# EAGLE board DE0EC8 (EAGLE 5.10), part 1 of 2
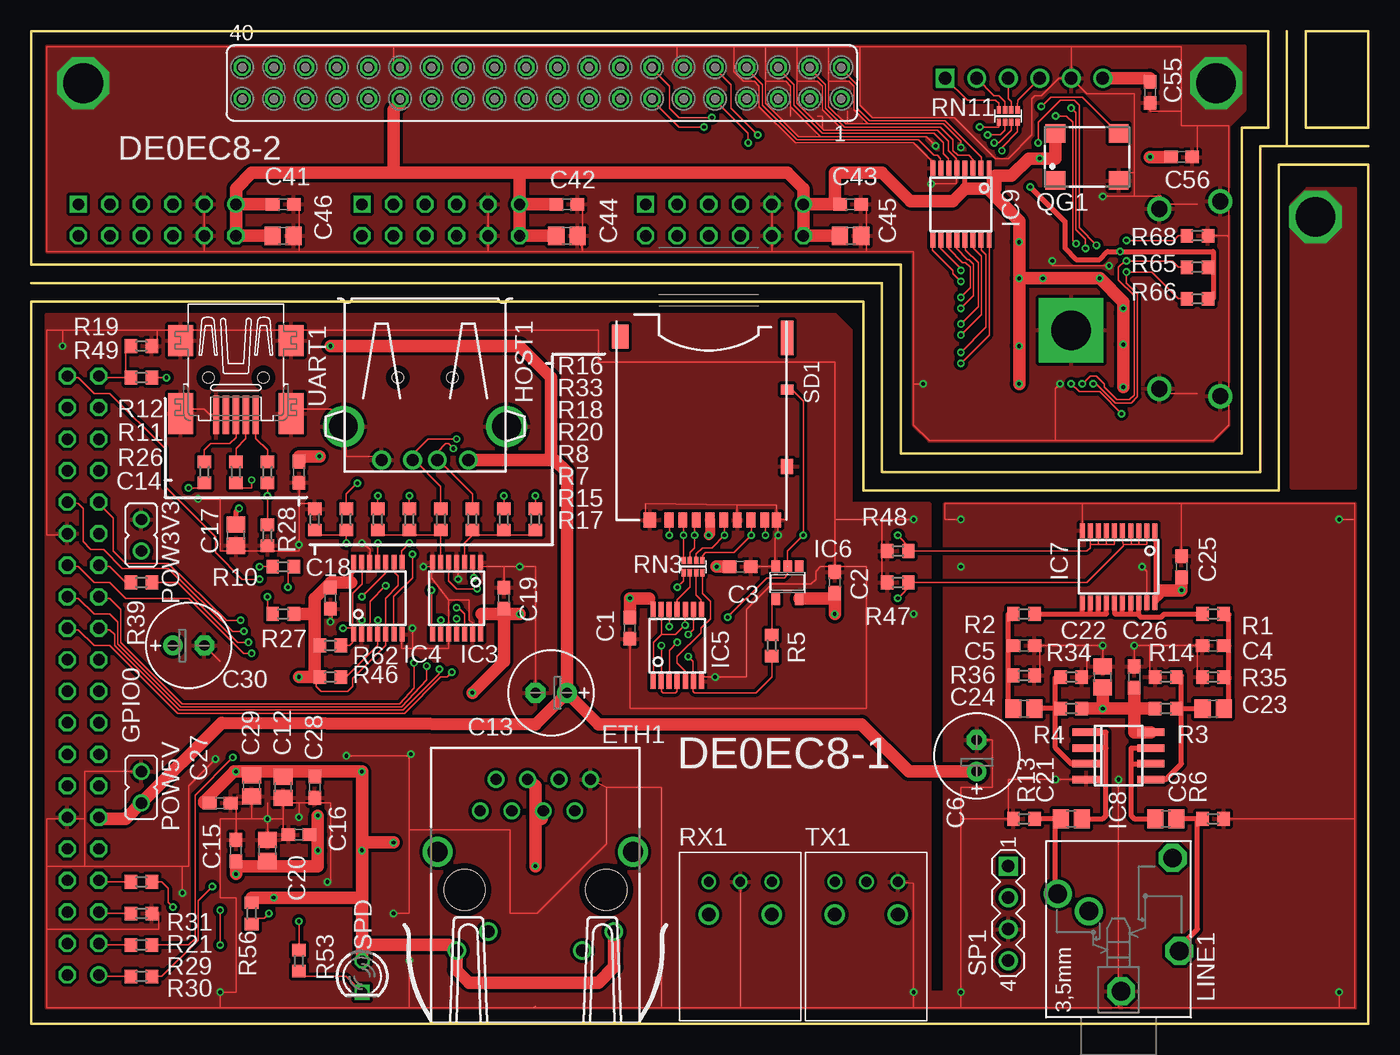
[diagram p2: board, top side]
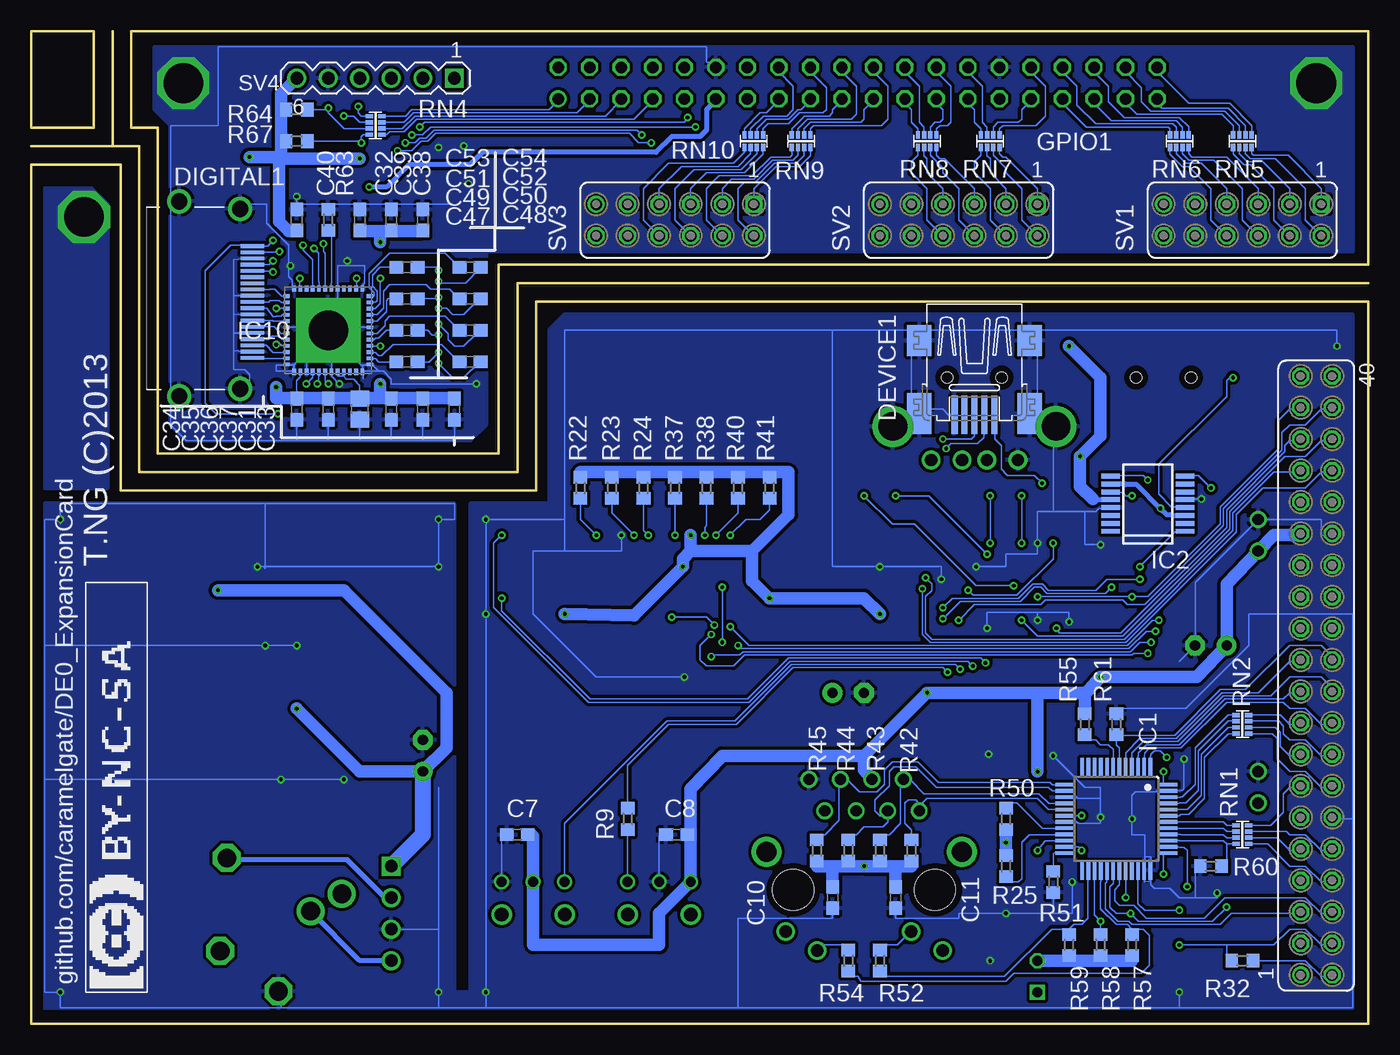
[diagram p3: board, bottom side, seen from below]

Size 107.77 x 80 mm. Coordinates in mm from the lower left corner, seen from the top.
Outline: 0,59.69 68.58,59.69 68.58,44.45 99.06,44.45 99.06,70.72 101.2,70.72
Outline: 101.2,70.72 101.2,80
Outline: 107.77,70.72 101.2,70.72
Outline: 0,0 107.77,0 107.77,69.22 100.56,69.22 100.56,42.95 67.08,42.95 67.08,58.19 0,58.19 0,0
Outline: 0,80 0,61.19 70.08,61.19 70.08,45.95 97.56,45.95 97.56,72.22 99.7,72.22 99.7,80 0,80
Outline: 107.77,80 102.7,80 102.7,72.22 107.77,72.22 107.77,80
Copper layers (1*16): Top 0.035mm / dielectric 1.53mm / Bottom 0.035mm
Design rules "pban_5mil-l2": minimum track width 5mil, minimum drill 0.3mm, track to track 5mil, track to pad 0.229mm, pad to pad 5mil, via to via 5mil, smd to smd 5mil, copper to edge 0.5mm, drill to drill 0.5mm, minimum pad ring 0.15mm, minimum via ring 0.15mm, stop-mask expansion 4mil, vias tented up to drill 0.35mm, thermal gap 10mil

## Footprints (pad centres in the part's own frame; a part is rotated, then mirrored left to right if it is on the bottom)
C1608 = smd 1.1 x 1: 1 -0.85,0; 2 0.85,0
E2,5-7 = drill 0.813 pad 1.6 round: + -1.27,0 | drill 0.813 pad 1.6 octagon: - 1.27,0
C2012 = smd 1.3 x 1.5: 1 -0.85,0; 2 0.85,0
32005-201 = smd 3.1 x 0.5: 1 3,1.6; 2 3,0.8; 3 3,0; 4 3,-0.8; 5 3,-1.6 | smd 2.5 x 2: M1 -3,-4.45; M2 -3,4.45 | smd 3.3 x 2: M3 2.9,4.45; M4 2.9,-4.45 | hole 0.9: 0,2.2; 0,-2.2
HDMI-FCI-A-UPDATE = smd 0.3 x 1.9: 1 4.75,8.5; 2 4.25,8.5; 3 3.75,8.5; 4 3.25,8.5; 5 2.75,8.5; 6 2.25,8.5; 7 1.75,8.5; 8 1.25,8.5; 9 0.75,8.5; 10 0.25,8.5; 11 -0.25,8.5; 12 -0.75,8.5; 13 -1.25,8.5; 14 -1.75,8.5; 15 -2.25,8.5; 16 -2.75,8.5; 17 -3.25,8.5; 18 -3.75,8.5; 19 -4.25,8.5 | drill 1.3 round: 20 -7.85,2.6; 21 7.85,2.6; 22 -7.25,7.5; 23 7.25,7.5
J0B = drill 0.9 pad 1.3 round: 1 -4.445,-1.27; 2 -3.175,1.27; 3 -1.905,-1.27; 4 -0.635,1.27; 5 0.635,-1.27; 6 1.905,1.27; 7 3.175,-1.27; 8 4.445,1.27 | drill 1 pad 1.422 round: 9 -6.325,-12.52; 10 -3.785,-11; 11 3.785,-12.52; 12 6.325,-11 | drill 1.6 pad 2.184 round: M1 -7.875,-4.57; M2 7.875,-4.57 | hole 3.3: 5.715,-7.62; -5.715,-7.62
FE20-2 = drill 0.914 round: 1 -24.13,1.27 | drill 0.914 octagon: 2 -24.13,-1.27; 3 -21.59,1.27; 4 -21.59,-1.27; 5 -19.05,1.27; 6 -19.05,-1.27; 7 -16.51,1.27; 8 -16.51,-1.27; 9 -13.97,1.27; 10 -13.97,-1.27; 11 -11.43,1.27; 12 -11.43,-1.27; 13 -8.89,1.27; 14 -8.89,-1.27; 15 -6.35,1.27; 16 -6.35,-1.27; 17 -3.81,1.27; 18 -3.81,-1.27; 19 -1.27,1.27; 20 -1.27,-1.27; 21 1.27,1.27; 22 1.27,-1.27; 23 3.81,1.27; 24 3.81,-1.27; 25 6.35,1.27; 26 6.35,-1.27; 27 8.89,1.27; 28 8.89,-1.27; 29 11.43,1.27; 30 11.43,-1.27; 31 13.97,1.27; 32 13.97,-1.27; 33 16.51,1.27; 34 16.51,-1.27; 35 19.05,1.27; 36 19.05,-1.27; 37 21.59,1.27; 38 21.59,-1.27; 39 24.13,1.27; 40 24.13,-1.27
USB-A = drill 1 round: 1 -3.5,12.99; 2 -1,12.99; 3 1,12.99; 4 3.5,12.99 | drill 2.3 round: P$1 -6.57,10.28; P$2 6.57,10.28
LQFP48 = smd 1.5 x 0.3: 1 -4.15,2.75; 2 -4.15,2.25; 3 -4.15,1.75; 4 -4.15,1.25; 5 -4.15,0.75; 6 -4.15,0.25; 7 -4.15,-0.25; 8 -4.15,-0.75; 9 -4.15,-1.25; 10 -4.15,-1.75; 11 -4.15,-2.25; 12 -4.15,-2.75; 25 4.15,-2.75; 26 4.15,-2.25; 27 4.15,-1.75; 28 4.15,-1.25; 29 4.15,-0.75; 30 4.15,-0.25; 31 4.15,0.25; 32 4.15,0.75; 33 4.15,1.25; 34 4.15,1.75; 35 4.15,2.25; 36 4.15,2.75 | smd 0.3 x 1.5: 13 -2.75,-4.15; 14 -2.25,-4.15; 15 -1.75,-4.15; 16 -1.25,-4.15; 17 -0.75,-4.15; 18 -0.25,-4.15; 19 0.25,-4.15; 20 0.75,-4.15; 21 1.25,-4.15; 22 1.75,-4.15; 23 2.25,-4.15; 24 2.75,-4.15; 37 2.75,4.15; 38 2.25,4.15; 39 1.75,4.15; 40 1.25,4.15; 41 0.75,4.15; 42 0.25,4.15; 43 -0.25,4.15; 44 -0.75,4.15; 45 -1.25,4.15; 46 -1.75,4.15; 47 -2.25,4.15; 48 -2.75,4.15
FT230X = smd 0.4 x 1.5: 1 -2.223,-2.99; 2 -1.587,-2.99; 3 -0.953,-2.99; 4 -0.318,-2.99; 5 0.318,-2.99; 6 0.953,-2.99; 7 1.587,-2.99; 8 2.223,-2.99; 9 2.223,2.99; 10 1.587,2.99; 11 0.953,2.99; 12 0.318,2.99; 13 -0.318,2.99; 14 -0.953,2.99; 15 -1.587,2.99; 16 -2.223,2.99
PW_R-PDSO-G14 = smd 0.4 x 1.2: 1 -1.95,-2.9; 2 -1.3,-2.9; 3 -0.65,-2.9; 4 0,-2.9; 5 0.65,-2.9; 6 1.3,-2.9; 7 1.95,-2.9; 8 1.95,2.9; 9 1.3,2.9; 10 0.65,2.9; 11 0,2.9; 12 -0.65,2.9; 13 -1.3,2.9; 14 -1.95,2.9
SOT23-5 = smd 0.69 x 0.99: 1 -0.95,-1.29; 2 0,-1.29; 3 0.95,-1.29; 4 0.95,1.3; 5 -0.95,1.3
PW_R-PDSO-G20 = smd 0.4 x 1.2: 1 -2.925,-2.9; 2 -2.275,-2.9; 3 -1.625,-2.9; 4 -0.975,-2.9; 5 -0.325,-2.9; 6 0.325,-2.9; 7 0.975,-2.9; 8 1.625,-2.9; 9 2.275,-2.9; 10 2.925,-2.9; 11 2.925,2.9; 12 2.275,2.9; 13 1.625,2.9; 14 0.975,2.9; 15 0.325,2.9; 16 -0.325,2.9; 17 -0.975,2.9; 18 -1.625,2.9; 19 -2.275,2.9; 20 -2.925,2.9
SO08 = smd 0.6 x 2.2: 1 -1.905,-2.6; 2 -0.635,-2.6; 3 0.635,-2.6; 4 1.905,-2.6; 5 1.905,2.6; 6 0.635,2.6; 7 -0.635,2.6; 8 -1.905,2.6
PW_R-PDSO-G16 = smd 0.4 x 1.2: 1 -2.275,-2.9; 2 -1.625,-2.9; 3 -0.975,-2.9; 4 -0.325,-2.9; 5 0.325,-2.9; 6 0.975,-2.9; 7 1.625,-2.9; 8 2.275,-2.9; 9 2.275,2.9; 10 1.625,2.9; 11 0.975,2.9; 12 0.325,2.9; 13 -0.325,2.9; 14 -0.975,2.9; 15 -1.625,2.9; 16 -2.275,2.9
QFN48-A = smd 0.5 x 0.3: 1 -3.35,2.75; 2 -3.35,2.25; 3 -3.35,1.75; 4 -3.35,1.25; 5 -3.35,0.75; 6 -3.35,0.25; 7 -3.35,-0.25; 8 -3.35,-0.75; 9 -3.35,-1.25; 10 -3.35,-1.75; 11 -3.35,-2.25; 12 -3.35,-2.75; 25 3.35,-2.75; 26 3.35,-2.25; 27 3.35,-1.75; 28 3.35,-1.25; 29 3.35,-0.75; 30 3.35,-0.25; 31 3.35,0.25; 32 3.35,0.75; 33 3.35,1.25; 34 3.35,1.75; 35 3.35,2.25; 36 3.35,2.75 | smd 0.3 x 0.5: 13 -2.75,-3.35; 14 -2.25,-3.35; 15 -1.75,-3.35; 16 -1.25,-3.35; 17 -0.75,-3.35; 18 -0.25,-3.35; 19 0.25,-3.35; 20 0.75,-3.35; 21 1.25,-3.35; 22 1.75,-3.35; 23 2.25,-3.35; 24 2.75,-3.35; 37 2.75,3.35; 38 2.25,3.35; 39 1.75,3.35; 40 1.25,3.35; 41 0.75,3.35; 42 0.25,3.35; 43 -0.25,3.35; 44 -0.75,3.35; 45 -1.25,3.35; 46 -1.75,3.35; 47 -2.25,3.35; 48 -2.75,3.35 | drill 3.2 pad 5.2 square: EXP 0,0
PG203JA = drill 1.499 octagon: 1 -5.004,-0.203; 4 5.74,-4.369; 5 -1.753,-4.902 | drill 1.499 round: 2 2.845,4.902; 3 1.448,2.388
JP1A = drill 0.914 round: 1 0,-1.27; 2 0,1.27
SM77H = smd 1.6 x 1.5: 1 -2.55,-1.9; 2 2.55,-1.9; 3 2.55,1.9; 4 -2.55,1.9
R0603 = smd 1 x 1.1: 1 -0.85,0; 2 0.85,0
EXB28V = smd 0.35 x 0.6: 1 -0.75,-0.5; 2 -0.25,-0.5; 3 0.25,-0.5; 4 0.75,-0.5; 5 0.75,0.5; 6 0.25,0.5; 7 -0.25,0.5; 8 -0.75,0.5
PL_13X/T10 = drill 0.8 round: 1 2.54,0; 2 0,0; 3 -2.54,0 | drill 1.1 round: 4 2.54,2.63; 5 -2.54,2.63
DM3A-SF-PEJ-A = smd 0.7 x 1.2: 1 3.2,16.55; 2 2.1,16.55; 3 1,16.55; 4 -0.1,16.55; 5 -1.2,16.55; 6 -2.3,16.55; 7 -3.4,16.55; 8 -4.5,16.55; CD1 -5.45,16.55 | smd 1 x 0.8: CD2 -6.325,6.05 | smd 1 x 1.2: GND1 4.75,16.55; GND2 -6.3,12.25 | smd 1 x 2.8: GND3 -6.325,1.875 | smd 1.3 x 1.9: GND4 7.125,1.775
MA04-1A = drill 1.016 square: 1 -3.81,0 | drill 1.016 round: 2 -1.27,0; 3 1.27,0; 4 3.81,0
LED3MM = drill 0.813 octagon: A -1.27,0 | drill 0.813 square: K 1.27,0
FE06-2P = drill 0.914 square: 1 6.35,1.27 | drill 0.914 octagon: 2 6.35,-1.27; 3 3.81,1.27; 4 3.81,-1.27; 5 1.27,1.27; 6 1.27,-1.27; 7 -1.27,1.27; 8 -1.27,-1.27; 9 -3.81,1.27; 10 -3.81,-1.27; 12 -6.35,-1.27 | drill 0.914 round: 11 -6.35,1.27
MA06-1A = drill 1.016 square: 1 -6.35,0 | drill 1.016 round: 2 -3.81,0; 3 -1.27,0; 4 1.27,0; 5 3.81,0; 6 6.35,0

## Placement (x,y rotation side)
C1  0.1u  [C1608]  48.26,31.88 90 top
C2  0.1u  [C1608]  64.77,35.56 270 top
C3  0.1u  [C1608]  57.15,36.83 180 top
C4  220p  [C1608]  95.25,30.48 180 top
C5  220p  [C1608]  80.01,30.48 0 top
C6  47uF  [E2,5-7]  76.2,21.59 90 top
C7  0.1u  [C1608]  68.58,15.24 0 bottom
C8  0.1u  [C1608]  55.75,15.24 0 bottom
C9  10u  [C2012]  91.44,16.51 0 top
C10  0.1u  [C1608]  43.18,10.16 270 bottom
C11  0.1u  [C1608]  38.1,10.16 270 bottom
C12  10u  [C2012]  20.32,19.05 270 top
C13  47uF  [E2,5-7]  41.91,26.67 180 top
C14  0.1u  [C1608]  21.59,44.45 90 top
C15  0.1u  [C1608]  16.51,13.97 90 top
C16  0.1u  [C1608]  21.59,15.24 180 top
C17  10u  [C2012]  16.51,39.37 90 top
C18  0.1u  [C1608]  24.13,34.29 90 top
C19  0.1u  [C1608]  38.1,34.29 270 top
C20  10u  [C2012]  19.05,13.97 90 top
C21  10u  [C2012]  83.82,16.51 180 top
C22  10u  [C2012]  86.36,27.94 90 top
C23  10u  [C2012]  95.25,25.4 180 top
C24  10u  [C2012]  80.01,25.4 0 top
C25  0.1u  [C1608]  92.71,36.83 270 top
C26  0.1u  [C1608]  88.9,27.94 270 top
C27  0.1u  [C1608]  15.24,17.78 0 top
C28  0.1u  [C1608]  22.86,19.05 270 top
C29  10u  [C2012]  17.78,19.18 270 top
C30  47uF  [E2,5-7]  12.7,30.48 0 top
C31  0.1uF  [C1608]  76.2,49.53 270 bottom
C32  0.1uF  [C1608]  81.28,64.77 90 bottom
C33  0.1uF  [C1608]  73.66,49.53 270 bottom
C34  0.1uF  [C1608]  86.36,49.53 270 bottom
C35  0.1uF  [C1608]  83.82,49.53 270 bottom
C36  0.1uF  [C1608]  78.74,49.53 270 bottom
C37  10u  [C2012]  81.28,49.53 270 bottom
C38  0.1uF  [C1608]  76.2,64.77 90 bottom
C39  0.1uF  [C1608]  78.74,64.77 90 bottom
C40  0.1uF  [C1608]  86.36,64.77 90 bottom
C41  0.1uF  [C1608]  20.32,66.04 180 top
C42  0.1uF  [C1608]  43.18,66.04 180 top
C43  0.1uF  [C1608]  66.04,66.04 180 top
C44  10u  [C2012]  43.18,63.5 180 top
C45  10u  [C2012]  66.04,63.5 180 top
C46  10u  [C2012]  20.32,63.5 180 top
C47  0.1uF  [C1608]  77.47,53.34 180 bottom
C48  0.1uF  [C1608]  72.39,53.34 180 bottom
C49  0.1uF  [C1608]  77.47,55.88 180 bottom
C50  0.1uF  [C1608]  72.39,55.88 180 bottom
C51  0.1uF  [C1608]  77.47,58.42 180 bottom
C52  0.1uF  [C1608]  72.39,58.42 180 bottom
C53  0.1uF  [C1608]  77.47,60.96 180 bottom
C54  0.1uF  [C1608]  72.39,60.96 180 bottom
C55  0.1uF  [C1608]  90.17,75.06 90 top
C56  0.1uF  [C1608]  92.71,69.85 0 top
DEVICE1  MINI-USB-SCHIELD-32005-201  [32005-201]  31.75,52.07 270 bottom
DIGITAL1  [HDMI-FCI-A-UPDATE]  98.42,58.42 270 bottom
ETH1  J0011D21BNL  [J0B]  40.64,18.41 0 top
GPIO0  [FE20-2]  4.2,28.06 90 bottom
GPIO1  [FE20-2]  41.16,75.8 180 top
HOST1  [USB-A]  31.75,58.42 180 top
IC1  DP83848C  [LQFP48]  20.32,16.51 270 bottom
IC2  FT230X  [FT230X]  17.78,41.91 90 bottom
IC3  74CBTLV3125TSSOP  [PW_R-PDSO-G14]  34.29,34.29 180 top
IC4  74VHC125TSSOP  [PW_R-PDSO-G14]  27.94,34.29 0 top
IC5  74VHC125TSSOP  [PW_R-PDSO-G14]  52.07,30.48 0 top
IC6  74LVC1G04DBV  [SOT23-5]  60.96,35.56 180 top
IC7  74VHC245TSSOP  [PW_R-PDSO-G20]  87.63,36.83 180 top
IC8  LM358D  [SO08]  87.63,21.59 270 top
IC9  FIN1047  [PW_R-PDSO-G16]  74.93,66.04 180 top
IC10  PTN3360D  [QFN48-A]  83.82,55.88 270 bottom
LINE1  AJ1780  [PG203JA]  87.63,7.62 90 top
POW3V3  [JP1A]  8.89,39.37 180 top
POW5V  [JP1A]  8.89,19.05 180 top
QG1  27MHz  [SM77H]  85.09,69.85 0 top
R1  2.2k  [R0603]  95.25,33.02 0 top
R2  2.2k  [R0603]  80.01,33.02 180 top
R3  100k  [R0603]  91.44,25.4 180 top
R4  100k  [R0603]  83.82,25.4 0 top
R5  10k  [R0603]  59.69,30.48 270 top
R6  56k  [R0603]  95.25,16.51 0 top
R7  22  [R0603]  35.56,40.64 90 top
R8  22  [R0603]  33.02,40.64 90 top
R9  100  [R0603]  59.69,16.51 270 bottom
R10  100  [R0603]  20.32,36.83 180 top
R11  22  [R0603]  16.51,44.45 90 top
R12  22  [R0603]  13.97,44.45 90 top
R13  56k  [R0603]  80.01,16.51 180 top
R14  100k  [R0603]  91.44,27.94 0 top
R15  1.5k  [R0603]  38.1,40.64 90 top
R16  10k  [R0603]  22.86,40.64 270 top
R17  15k  [R0603]  40.64,40.64 270 top
R18  15k  [R0603]  27.94,40.64 270 top
R19  10k  [R0603]  8.89,54.61 180 top
R20  1.5k  [R0603]  30.48,40.64 90 top
R21  10k  [R0603]  8.89,8.89 180 top
R22  10k  [R0603]  63.5,43.18 90 bottom
R23  10k  [R0603]  60.96,43.18 90 bottom
R24  10k  [R0603]  58.42,43.18 90 bottom
R25  2.2k  [R0603]  29.21,12.7 90 bottom
R26  4.7k(4.87k)  [R0603]  19.05,44.45 90 top
R27  10k  [R0603]  20.32,33.02 180 top
R28  10k  [R0603]  19.05,39.37 90 top
R29  100  [R0603]  8.89,6.35 0 top
R30  100  [R0603]  8.89,3.81 0 top
R31  100  [R0603]  8.89,11.43 0 top
R32  100  [R0603]  10.16,5.08 180 bottom
R33  1.5k  [R0603]  25.4,40.64 90 top
R34  100k  [R0603]  83.82,27.94 180 top
R35  2.2k  [R0603]  95.25,27.94 180 top
R36  2.2k  [R0603]  80.01,28.07 180 top
R37  10k  [R0603]  55.88,43.18 90 bottom
R38  10k  [R0603]  53.34,43.18 90 bottom
R39  100  [R0603]  8.89,35.56 0 top
R40  10k  [R0603]  50.8,43.18 90 bottom
R41  10k  [R0603]  48.26,43.18 90 bottom
R42  50  [R0603]  36.83,13.97 270 bottom
R43  50  [R0603]  39.37,13.97 270 bottom
R44  50  [R0603]  41.91,13.97 270 bottom
R45  50  [R0603]  44.45,13.97 270 bottom
R46  10k  [R0603]  24.13,27.94 0 top
R47  10k  [R0603]  69.85,35.56 0 top
R48  10k  [R0603]  69.85,38.1 0 top
R49  100  [R0603]  8.89,52.07 0 top
R50  2.2k  [R0603]  29.21,16.51 270 bottom
R51  4.87k  [R0603]  25.4,11.43 270 bottom
R52  120  [R0603]  39.37,5.08 90 bottom
R53  220  [R0603]  21.59,5.08 270 top
R54  120  [R0603]  41.91,5.08 90 bottom
R55  10k  [R0603]  22.86,24.13 90 bottom
R56  1.5k  [R0603]  17.78,8.89 270 top
R57  2.2k  [R0603]  19.05,6.35 270 bottom
R58  2.2k  [R0603]  21.59,6.35 270 bottom
R59  2.2k  [R0603]  24.13,6.35 270 bottom
R60  10k  [R0603]  12.7,12.7 0 bottom
R61  10k  [R0603]  20.32,24.13 270 bottom
R62  10k  [R0603]  24.13,30.48 0 top
R63  10k  [R0603]  83.82,64.77 270 bottom
R64  10k  [R0603]  86.36,73.66 180 bottom
R65  2.2k  [R0603]  93.98,60.96 0 top
R66  2.2k  [R0603]  93.98,58.42 0 top
R67  10k  [R0603]  86.36,71.12 180 bottom
R68  22k  [R0603]  93.98,63.5 180 top
RN1  100  [EXB28V]  10.16,15.24 90 bottom
RN2  100  [EXB28V]  10.16,24.13 90 bottom
RN3  100  [EXB28V]  53.34,36.83 0 top
RN4  100  [EXB28V]  80.01,72.39 90 bottom
RN5  100  [EXB28V]  10.16,71.12 180 bottom
RN6  100  [EXB28V]  15.24,71.12 180 bottom
RN7  100  [EXB28V]  30.48,71.12 180 bottom
RN8  100  [EXB28V]  35.56,71.12 180 bottom
RN9  100  [EXB28V]  45.72,71.12 180 bottom
RN10  100  [EXB28V]  49.53,71.12 180 bottom
RN11  100  [EXB28V]  78.74,73.15 0 top
RX1  PLR135T10  [PL_13X/T10]  57.15,11.43 180 top
SD1  USD-SOCKETHIROSE-A  [DM3A-SF-PEJ-A]  54.61,57.15 180 top
SP1  [MA04-1A]  78.74,8.89 270 top
SPD  [LED3MM]  26.67,3.81 270 top
SV1  [FE06-2P]  10.16,64.77 0 bottom
SV2  [FE06-2P]  33.02,64.77 0 bottom
SV3  [FE06-2P]  55.88,64.77 0 bottom
SV4  [MA06-1A]  80.01,76.2 180 bottom
TX1  PLT133T10  [PL_13X/T10]  67.31,11.43 180 top
UART1  MINI-USB-SCHIELD-32005-201  [32005-201]  16.51,52.07 270 top

## Tracks (layer width: path | path; a pad name or v marks a point on that pad's centre or on a via)
+3V3  (via drill 0.3)
  Top 0.127: 28.57,30.48 28.59,30.97 IC4.5 28.59,31.48 28.57,31.75 28.57,34.29 29.59,35.31 29.59,36.07 29.21,36.45 29.21,36.96 29.24,37.11 IC4.9 29.21,37.22 29.21,37.72 | 28.57,30.48 28.57,31.11 | 28.57,30.48 25.91,27.81 25.91,27.18 25.53,26.8 23.37,26.8 22.99,27.18 22.99,27.94 v21.59,27.94
  Top 0.406: IC5.14 50.12,33.95 49.78,34.29 | IC4.14 25.99,36.53 25.78,36.32 25.78,35.56 | IC3.14 36.24,32.94 36.32,33.02
  Top 0.813: v54.61,39.37 54.74,39.48 54.74,40.6 SD1.4
  Top 1.016: v55.24,36.83 C3.2 | 49.78,34.29 v48.26,34.29 C1.2 | v64.77,33.02 64.77,34.16 | 64.77,34.16 C2.2 | IC6.5 61.95,34.26 61.98,34.29 64.64,34.29 64.77,34.16 | 22.86,33.02 R27.1 | 22.86,27.94 R46.1 | 22.86,30.48 R62.1 | 38.1,33.02 C19.2 | v35.56,26.67 38.1,29.21 38.1,33.02 | 38.1,33.02 v39.37,33.02 | ETH1.4 40.64,19.18 40.64,16.64 | ETH1.5 41.15,16.51 40.64,16.64 | 40.64,16.64 v40.64,12.7 | 34.24,5.77 ETH1.9 34.31,5.74 34.29,5.71 | 26.67,6.35 33.66,6.35 34.24,5.77 | 34.24,5.77 34.29,5.71 | SPD.A 26.67,6.35 | 26.67,6.35 26.67,10.16 | R56.1 17.78,10.16 v19.56,10.16 26.67,10.16 | 24.13,35.56 C18.2 | 24.13,35.56 25.78,35.56 | 38.1,33.02 36.32,33.02 | 26.67,14.61 v26.67,20.32 22.86,20.32 | 26.67,14.61 v26.67,13.97 26.67,10.16 | 26.67,14.61 v29.21,14.61 | 22.86,20.32 20.32,20.32 | 20.32,20.32 17.78,20.32 | 17.78,20.32 v16.51,20.32 16.38,20.32 13.97,17.91 13.97,17.78 C27.1 | 24.13,35.56 22.86,34.29 22.86,33.02 | 22.86,20.32 C28.1 | 20.32,20.32 C12.1 | 17.78,20.32 C29.1 | 22.86,30.48 22.86,33.02 | v21.59,27.94 22.86,27.94 | 22.86,27.94 22.86,30.48 | ETH1.12 46.97,7.01 46.99,6.35 46.99,4.57 45.72,3.3 35.31,3.3 34.29,4.32 34.29,5.71
  Bottom 0.127: IC1.22 24.74,14.76 24.77,14.73 26.04,14.73 v26.67,13.97 | IC1.32 19.57,11.82 19.56,11.81 v19.56,10.16 | IC1.48 16.47,19.26 16.51,19.3 v16.51,20.32
  Bottom 1.016: GPIO0.29 5.46,39.37 7.62,39.37 POW3V3.2 11.43,35.43 C30.+ 13.84,27.94 v21.59,27.94 22.86,26.54 | 54.61,38.23 54.61,38.1 55.24,37.47 v55.24,36.83 59.18,32.89 v64.77,33.02 | 54.61,38.23 v54.61,39.37 | R22.2 63.5,44.45 60.96,44.45 | 48.26,44.45 46.74,44.45 46.74,41.02 49.66,38.1 | 48.26,44.45 50.67,44.45 | 50.67,44.45 53.34,44.45 | 53.34,44.45 55.75,44.45 | 55.75,44.45 58.55,44.45 | 58.55,44.45 60.96,44.45 | 49.66,38.1 54.48,38.1 54.61,38.23 | 48.26,44.45 R41.2 | R40.2 50.8,44.32 50.67,44.45 | 53.34,44.45 R38.2 | R37.2 55.88,44.32 55.75,44.45 | R24.2 58.42,44.32 58.55,44.45 | 60.96,44.45 R23.2 | 49.66,38.1 49.66,35.69 v48.26,34.29 40.64,34.29 v39.37,33.02 | 26.67,26.67 v35.56,26.67 40.64,21.59 | C7.2 67.44,15.24 67.31,15.11 TX1.2 67.31,6.35 57.15,6.35 57.15,8.89 RX1.1 | C8.2 54.61,15.24 RX1.1 | RX1.1 54.61,18.92 52.07,21.59 40.64,21.59 | 40.64,21.59 40.64,20.45 ETH1.4 | R45.2 44.45,13.08 44.32,12.95 44.32,12.7 | 44.32,12.7 44.45,12.7 | 37.85,12.7 36.83,12.7 R42.2 | 39.37,12.7 37.85,12.7 | 43.18,12.7 44.32,12.7 | C11.1 38.1,12.32 37.85,12.7 | 39.37,12.7 R43.2 | R44.2 41.91,12.95 41.78,12.7 | 43.18,12.7 C10.1 | 41.78,12.7 v40.64,12.7 39.37,12.7 | 41.78,12.7 43.18,12.7 | 21.59,5.08 19.05,5.08 R57.2 | 21.59,5.08 R58.2 | 21.59,5.08 24.13,5.08 | 24.13,5.08 R59.2 | 24.13,5.08 SPD.A | 22.86,26.54 R55.2 | 26.67,26.67 22.86,26.67 22.86,26.54 | v26.67,20.32 26.67,26.67 | R25.2 v29.21,14.61 R50.2
+5V  (via drill 0.3)
  Top 0.406: 91.06,34.92 91.06,34.41 IC7.20 90.68,34.05 90.68,38.86 90.56,38.98 IC7.1
  Top 1.016: GPIO0.11 5.46,16.5 6.35,16.51 7.62,16.51 POW5V.2 15.37,24.26 40.64,24.13 C13.+ | C13.+ 45.72,24.13 66.93,24.13 70.74,20.32 C6.+ | 41.91,45.43 42.2,45.43 43.18,44.45 C13.+ | 41.91,45.43 HOST1.1 | 21.63,45.3 C14.2 21.59,45.72 v23.24,45.72 | v24.13,54.61 39.37,54.61 41.91,52.07 41.91,45.43 | 86.36,27.05 C22.1 v86.36,25.4 | 86.36,27.05 86.42,26.99 86.36,26.67 v86.36,25.4 | 88.9,25.4 C26.2 | IC8.8 88.9,23.5 88.9,25.4 | 88.9,25.4 R3.2 | v86.36,25.4 R4.2 | v86.36,25.4 88.9,25.4 | v86.36,25.4 86.36,27.05 | 91.06,34.92 v92.71,34.92 C25.2
  Bottom 0.406: IC2.12 21.91,42.23 21.97,42.29 22.23,42.29
  Bottom 1.016: v24.13,54.61 21.59,52.07 21.59,47.37 v23.24,45.72 23.24,43.31 22.23,42.29 | v86.36,25.4 81.28,20.32 C6.+ 74.3,22.23 74.3,26.67 82.55,34.92 v92.71,34.92
  Bottom 1.27: SP1.1 76.2,15.24 C6.+
ALOUT
  Top 0.406: 93.98,16.51 R6.1 | 93.98,16.51 C9.2 | 93.98,16.51 93.98,7.62 92.53,6.17 LINE1.5
AROUT
  Top 0.406: 82.55,16.51 R13.1 | LINE1.2 82.73,11.25 82.55,11.43 82.55,16.51 | 82.55,16.51 C21.2
CD  (via drill 0.3)
  Top 0.127: SD1.CD2 61.09,51.2 61.34,51.05 62.23,50.16 v62.23,39.37 60.96,38.1 IC6.2 60.96,36.2 60.71,35.94 59.31,35.94 v56.13,32.77 | 50.8,31.37 51.94,31.37 v52.7,32.13 52.7,33.37 IC5.10 | 50.8,31.37 50.16,30.73 50.16,27.62 IC5.1 | 50.8,31.37 50.8,33.27 50.77,33.3 IC5.13 50.8,33.41 50.8,33.15
  Bottom 0.127: v62.23,39.37 63.5,40.64 R22.1 | v56.13,32.77 53.34,32.77 v52.7,32.13
CS  (via drill 0.3)
  Top 0.127: SD1.2 52.64,40.58 52.58,40.51 v52.58,39.37 52.58,37.47 52.59,37.71 RN3.8
  Bottom 0.127: v52.58,39.37 50.8,41.15 R40.1
D3V3  (via drill 0.3)
  Top 0.127: 88.01,57.28 v88.01,57.66 | 77.09,67.31 77.09,67.58 77.2,67.69
  Top 0.406: IC9.1 77.2,67.69 77.2,67.45 77.34,67.31 | IC9.4 75.25,67.37 75.31,67.31
  Top 1.016: GPIO1.29 29.73,74.18 29.21,73.66 29.21,68.58 | 29.21,68.58 17.78,68.58 16.51,67.31 SV1.11 | SV1.11 SV1.12 C46.2 | SV1.11 C41.2 | 29.21,68.58 39.37,68.58 | 39.37,68.58 SV2.11 | SV2.11 SV2.12 C44.2 | SV2.11 C42.2 | SV3.11 SV3.12 C45.2 | SV3.11 62.23,67.31 60.96,68.58 39.37,68.58 | SV3.11 64.77,66.04 | v88.01,51.31 v88.01,54.74 88.01,57.28 88.01,58.17 v86.11,60.07 v81.53,60.07 v79.63,60.07 | 64.77,66.04 C43.2 | 64.77,66.04 64.77,68.58 68.58,68.58 70.87,66.29 74.3,66.29 75.31,67.31 77.09,67.31 | 77.09,67.31 77.72,67.31 77.72,68.33 78.99,68.33 80.39,69.72 v81.28,69.72 82.55,69.72 82.55,71.12 82.56,71.12 QG1.4 | 77.09,67.31 79.65,64.67 | 79.65,64.67 v79.63,62.99 | C55.2 90.17,76.2 SV4.6 | v79.63,62.99 | 79.65,64.67 v79.63,62.99 | v79.63,62.99 | v79.63,51.56 v79.63,54.61 v79.63,60.07 | v79.63,62.99 | v79.63,62.99 v79.63,60.07 | v90.17,69.85 C56.1
  Bottom 0.127: 87.65,54.63 IC10.21 87.48,54.63 87.63,54.74 v88.01,54.74 | IC10.15 87.47,57.63 87.12,57.66 v88.01,57.66 | IC10.11 86.07,59.4 86.11,59.44 v86.11,60.07 | 82.55,52.2 82.42,51.94 81.79,51.94 81.28,51.44 81.28,50.42 | 83.06,52.2 83.07,52.21 IC10.32 83.06,52.59 83.06,52.2 | IC10.33 82.57,52.22 82.55,52.2 | 82.55,52.2 83.06,52.2 | IC10.26 86.07,52.11 86.36,51.82 86.36,50.42 | IC10.40 80.41,54.63 80.39,54.61 v79.63,54.61 | IC10.46 80.04,57.63 79.63,58.04 v79.63,60.07 | IC10.2 81.57,59.27 81.53,59.31 v81.53,60.07
  Bottom 1.016: v88.01,51.31 88.01,50.42 86.36,50.42 | 83.95,50.42 86.36,50.42 | 86.36,50.42 C34.1 | 83.95,50.42 C35.1 | 81.28,50.42 83.95,50.42 | 78.74,50.42 C36.1 79.63,50.42 | 79.63,50.42 78.74,50.42 | 79.63,50.42 81.28,50.42 | C33.1 73.79,50.38 73.91,50.42 76.2,50.42 | 78.74,50.42 76.2,50.42 | 76.2,50.42 C31.1 | 81.28,50.42 C37.1 | v81.28,69.72 87.63,69.72 87.63,69.98 | 87.63,70.99 87.63,73.79 | 87.63,73.79 87.63,74.93 SV4.6 | 87.63,73.79 R64.2 | 87.63,70.99 R67.2 | 87.63,69.98 87.76,69.98 87.76,64.64 87,63.88 86.36,63.88 C40.1 | C32.1 81.28,63.88 79.63,63.88 | C38.1 76.2,63.88 78.87,63.88 | 78.87,63.88 C39.1 | 79.63,63.88 78.87,63.88 | v79.63,62.99 79.63,63.88 | 87.63,69.98 87.63,70.99 | 87.63,69.98 87.76,69.85 v90.17,69.85 | v79.63,51.56 79.63,50.42
DA0  (via drill 0.3)
  Top 0.127: GPIO0.25 5.59,34.29 6.35,34.29 7.24,33.4 7.24,30.73 12.19,25.78 29.72,25.78 30.86,27.05 v30.86,29.08 | 70.99,35.56 85.09,35.56 88.01,38.48 88.01,38.61 | IC7.5 87.95,38.92 88.01,38.61 | IC7.4 88.61,39.03 88.65,38.99 88.65,38.61 | 88.01,38.61 88.65,38.61 | IC7.3 89.25,39.02 89.28,38.99 89.28,38.61 | 88.65,38.61 89.28,38.61 | IC7.2 89.91,38.62 89.92,38.61 89.28,38.61 | 70.99,35.56 R47.2 | 70.99,35.56 70.99,35.43 v69.85,34.29
  Bottom 0.127: 69.85,34.16 v69.85,34.29 69.85,33.27 62.74,26.16 50.04,26.16 46.74,29.46 31.24,29.46 v30.86,29.08
DA1  (via drill 0.3)
  Top 0.127: GPIO0.26 2.93,34.28 3.81,34.29 5.08,33.02 6.35,33.02 6.99,32.38 6.99,30.61 12.06,25.53 29.84,25.53 31.88,27.69 v31.88,28.83 | IC7.9 85.36,38.75 85.34,38.73 85.34,38.61 | 85.34,38.61 85.34,38.35 85.09,38.1 R48.2 71.12,37.68 71.12,37.97 v69.85,39.37 | 86,38.63 IC7.8 | 86,38.63 85.98,38.61 85.34,38.61 | 86.66,38.65 IC7.7 | 86.66,38.65 86.61,38.61 86.03,38.61 86,38.63 | IC7.6 87.31,38.66 87.25,38.61 86.7,38.61 86.66,38.65
  Bottom 0.127: v31.88,28.83 32.26,29.21 46.61,29.21 49.91,25.91 62.87,25.91 70.48,33.53 70.48,38.73 v69.85,39.37
DGND  (via drill 0.3, 3.2)
  Top 0.127: GPIO1.12 52.47,77.07 52.07,77.47 52.07,78.74 | 29.21,78.74 1.27,78.74 1.27,62.23 13.97,62.23 | 29.21,78.74 52.07,78.74 | 13.97,62.23 SV1.10 SV1.9 | GPIO1.30 29.61,77.07 29.21,77.47 29.21,78.74 | C41.1 21.59,66.04 21.59,63.5 | 21.59,63.5 C46.1 | 13.97,62.23 21.59,62.23 | 21.59,62.23 36.83,62.23 | 36.83,62.23 SV2.10 SV2.9 | 44.45,63.5 44.45,63.92 | C44.1 44.03,63.92 44.45,62.23 | 36.83,62.23 44.45,62.23 | 44.45,63.5 C44.1 | 44.45,62.23 44.45,63.5 | 44.45,62.23 59.69,62.23 | 59.69,62.23 SV3.10 SV3.9 | 59.69,62.23 67.31,62.23 | C43.1 67.31,66.04 67.31,63.5 | 67.31,63.5 C45.1 | 67.31,62.23 67.31,63.5 | 67.31,62.23 71.12,62.23 71.12,51.56 | 96.52,66.04 96.52,72.39 93.98,72.39 | 96.52,66.04 96.52,63.37 | 96.52,50.8 96.52,63.37 | 96.52,50.8 96.52,48.26 95.25,46.99 82.55,46.99 | 92.71,73.53 92.71,78.74 83.82,78.74 | 92.71,73.53 92.71,72.39 93.98,72.39 | 52.07,78.74 56.64,78.74 | 72.52,69.6 71.12,70.99 61.59,70.99 58.67,73.91 58.67,75.56 58.29,75.95 57.4,75.95 56.64,76.71 56.64,78.74 | 72.52,69.6 72.64,69.47 72.64,68.96 IC9.8 | 56.64,78.74 59.18,78.74 | v72.9,70.74 72.14,71.5 63.63,71.5 | 63.63,71.5 61.85,71.5 59.18,74.17 59.18,75.95 | 59.18,78.74 59.18,75.95 | 59.18,78.74 61.72,78.74 | 65.41,72.01 63.75,73.66 63.75,75.56 63.37,75.95 61.72,75.95 | 63.75,72.14 63.75,73.15 63.37,73.15 | 61.72,78.74 61.72,75.95 | 61.72,78.74 64.26,78.74 | v74.93,70.61 74.93,71.12 73.53,72.52 67.44,72.52 | 64.26,75.95 64.26,73.91 65.66,72.52 65.79,72.52 | 64.26,78.74 64.26,75.95 | 64.26,78.74 66.8,78.74 | SV4.5 82.8,76.2 81.41,74.8 80.9,74.8 80.64,74.55 80.64,71.63 78.74,69.72 77.72,69.72 74.42,73.03 67.82,73.03 66.8,74.04 66.8,78.74 | 66.8,78.74 83.82,78.74
  Top 0.127: C42.1 44.45,66.04 44.45,63.92 | 44.45,63.92 C44.1 | 21.59,62.23 21.59,63.5 | 83.82,78.74 SV4.5 | QG1.2 87.62,68.57 88.9,68.58 | 88.9,68.58 88.9,74.93 85.09,74.93 SV4.5 | C55.1 90.17,73.53 92.71,73.53 | 93.73,69.72 C56.2 | 93.73,69.72 93.47,69.85 | 93.73,69.72 93.98,69.72 93.98,72.39 | 93.98,66.04 90.3,66.04 90.29,66.03 DIGITAL1.22 91.06,66.67 88.9,66.67 | DIGITAL1.20 95.19,66.23 95.38,66.04 96.52,66.04 | DIGITAL1.21 95.19,50.61 95.38,50.8 96.52,50.8 | DIGITAL1.23 90.67,51.06 90.17,50.8 93.98,50.8 | R68.1 96.39,63.5 96.52,63.37 | 82.55,46.99 82.55,51.18 v82.93,51.56 | 82.55,46.99 72.39,46.99 71.12,48.26 71.12,51.56 | 61.72,75.95 61.72,74.17 63.75,72.14 | 61.21,73.91 61.21,75.56 60.83,75.95 59.18,75.95 | 61.21,73.91 61.21,73.15 | 63.63,71.5 61.21,73.91 | 64.26,75.95 65.91,75.95 66.29,75.56 66.29,73.66 67.44,72.52 | 65.79,72.52 67.44,72.52 | 65.79,72.52 65.79,73.53 | 63.75,72.14 63.88,72.01 65.41,72.01 | 65.41,72.01 73.03,72.01 73.91,71.12 73.91,70.36 74.55,69.72 74.55,69.47 | IC9.5 74.61,69.29 74.55,69.47 | 88.9,66.67 v86.36,66.67 | 88.9,68.58 88.9,66.67 | v86.87,61.09 82.3,61.09 v82.3,61.47 | 71.12,51.56 v71.88,51.56 | 74.55,69.47 74.55,67.69 v72.52,67.69 72.52,69.6
  Bottom 0.127: C33.2 73.66,46.99 76.2,46.99 | 86.36,46.99 95.25,46.99 96.52,48.26 96.52,72.39 92.71,72.39 92.71,78.74 53.34,78.74 53.34,77.47 52.99,77.47 GPIO1.12 | 86.36,46.99 83.82,46.99 | 83.82,46.99 81.28,46.99 | 81.28,46.99 78.74,46.99 | 78.74,46.99 76.2,46.99 | 76.2,46.99 C31.2 | 78.74,46.99 C36.2 | 81.28,46.99 C37.2 | 83.82,46.99 C35.2 | 86.36,46.99 C34.2 | IC10.EXP 83.82,54.48 83.57,54.23 83.57,53.98 | 83.57,52.61 83.57,53.85 | 83.57,53.85 83.57,53.98 | 83.57,52.61 IC10.31 | v82.93,51.56 83.57,52.2 83.57,52.61 | DIGITAL1.2 90.62,54.17 91.44,54.23 | 91.44,54.23 91.44,55.63 | 90.13,55.67 DIGITAL1.5 90.63,55.67 91.44,55.63 | 91.44,55.63 90.13,55.67 | DIGITAL1.8 90.57,57.17 91.44,57.15 | 91.44,55.63 91.44,55.71 | 91.44,55.71 91.44,57.15 | 90.13,55.67 91.44,55.71 | DIGITAL1.11 90.55,58.67 91.44,58.67 | 91.44,57.15 91.44,58.67 | DIGITAL1.17 90.6,61.67 91.44,61.59 91.44,58.67 | IC10.18 86.36,56.13 86.11,55.88 IC10.EXP | IC10.EXP 83.82,58.17 83.06,58.17 83.07,58.18 IC10.5 83.07,59.8 83.06,59.82 83.06,61.09 80.9,61.09 80.9,59.69 81.07,59.52 IC10.1 | IC10.43 81.53,56.13 81.79,55.88 IC10.EXP | IC10.36 81.07,53 81.15,53.09 | 81.15,53.09 82.04,53.98 83.57,53.98 | IC10.37 80.52,53.09 80.56,53.13 80.82,53.13 80.77,53.09 | 80.77,53.09 81.15,53.09 | 86.57,53.13 IC10.25 | 86.57,53.13 85.85,53.85 85.6,53.85 | 83.57,53.85 85.6,53.85 | 86.57,53.13 IC10.24 | IC10.27 85.57,53.82 85.6,53.85 | 91.44,54.23 91.44,52.7 90.55,52.7 90.17,52.32 90.17,51.44 90.29,51.31 DIGITAL1.23 | IC10.12 86.57,59.27 86.74,59.44 86.74,59.94 87,60.2 87,62.74 88.77,64.52 88.77,66.04 90.81,66.04 DIGITAL1.22 | 86.36,66.04 C40.2 | 86.36,66.04 83.69,66.04 | R63.1 83.82,65.91 83.69,66.04
  Bottom 0.127: 83.69,66.04 81.28,66.04 C32.2 80.86,66.04 78.74,66.04 | 73.79,66.04 76.2,66.04 C38.2 76.62,66.04 78.74,66.04 | 78.74,66.04 C39.2 | v86.36,66.67 86.36,66.04 | 86.57,53.13 86.61,53.09 | 87.88,52.58 86.61,52.58 86.61,53.09 | 86.61,53.09 88.01,53.09 88.01,52.58 87.12,52.58 | 79.76,52.58 81.03,52.58 81.03,51.94 | 80.77,53.09 80.26,53.09 79.76,52.58 | 79.76,52.58 79.38,52.58 78.74,51.94 78.74,51.56 v71.88,51.56
  other vias: 4.2,75.8 95.5,75.8
  pour Top (isolate 0.254): 1.27,78.74 1.27,62.23 71.12,62.23 71.12,48.26 72.39,46.99 95.25,46.99 96.52,48.26 96.52,72.39 97.79,73.66 97.79,78.74
  pour Bottom (isolate 0.254): 1.27,78.74 1.27,62.23 71.12,62.23 71.12,48.26 72.39,46.99 95.25,46.99 96.52,48.26 96.52,72.39 97.79,73.66 97.79,78.74
DI  (via drill 0.3)
  Top 0.127: SD1.3 53.48,40.91 53.47,40.51 v53.47,39.37 53.47,38.35 53.09,37.98 RN3.7
  Bottom 0.127: v53.47,39.37 53.47,40.01 53.34,40.13 R38.1
DM  (via drill 0.3)
  Top 0.127: HOST1.2 32.93,45.43 33.15,45.21 33.15,45.09 35.56,42.67 R7.2 | HOST1.2 32.75,45.58 32.77,45.59 | v34.04,46.35 33.66,46.74 33.4,46.74 32.75,46.09 HOST1.2
  Bottom 0.127: DEVICE1.2 30.95,47.54 30.99,47.5 30.99,47.24 31.5,46.74 33.66,46.74 v34.04,46.35
DO  (via drill 0.3)
  Top 0.127: SD1.7 58.01,40.41 58.04,40.26 | 58.04,40.26 58.04,40.51 | 58.04,40.26 v58.04,39.37 56.64,37.97 54.36,37.97 54.09,37.71 RN3.5
  Bottom 0.127: v58.04,39.37 58.42,39.75 R24.1
DP  (via drill 0.3)
  Top 0.127: R8.2 33.02,43.31 30.9,45.43 HOST1.3 30.75,45.86 32,47.12 v34.29,47.12
  Bottom 0.127: DEVICE1.3 31.75,47.37 32,47.12 v34.29,47.12
DV5V  (via drill 0.3)
  Top 0.406: 95.25,60.96 95.25,62.23 v87.76,62.23 86.74,62.23 86.11,61.59 84.2,61.59 83.31,62.48 83.31,64.64 v80.52,67.44 | 95.25,60.96 R65.2 | R66.2 95.25,58.42 95.25,60.96
  Bottom 0.127: DIGITAL1.18 87.82,62.17 v87.76,62.23
  Bottom 0.406: GPIO1.11 52.59,74.43 53.34,73.66 53.34,72.01 53.85,71.5 56.13,71.5 57.4,70.23 71.37,70.23 72.39,69.22 77.34,69.22 79.12,67.44 v80.52,67.44
DV_CLK
  Bottom 0.127: GPIO1.1 65.29,74.41 66.04,73.66 77.09,73.66 77.6,73.15 78.75,73.14 RN4.4
DV_CLK27  (via drill 0.3)
  Top 0.127: v81.41,73.91 82.17,74.68 84.71,74.68 87,72.39 87.63,72.39 QG1.3
  Bottom 0.127: RN4.5 80.76,73.14 80.64,73.15 81.15,73.15 81.41,73.41 v81.41,73.91
DV_HPD
  Bottom 0.127: GPIO1.3 62.75,74.41 63.75,73.41 76.96,73.41 77.72,72.64 79,72.64 RN4.3
DV_SCL
  Bottom 0.127: GPIO1.7 57.67,74.41 59.18,72.9 76.71,72.9 77.72,71.88 78.87,71.88 79.11,71.64 RN4.1
DV_SDA
  Bottom 0.127: GPIO1.5 60.21,74.41 61.47,73.15 76.83,73.15 77.85,72.14 79.12,72.14 RN4.2
DV_TX0
  Top 0.127: GPIO1.2 65.29,76.95 66.55,75.69 66.55,73.79 67.56,72.77 73.66,72.77 76.58,69.85 76.58,69.34 76.56,69.32 IC9.2
DV_TX1
  Top 0.127: GPIO1.4 62.75,76.95 64.01,75.69 64.01,73.79 65.53,72.26 73.28,72.26 74.3,71.25 74.3,70.36 74.68,69.98 75.56,69.98 75.95,69.6 75.95,69.09 75.91,69.05 IC9.3
DV_TX2
  Top 0.127: GPIO1.6 60.21,76.95 61.47,75.69 61.47,74.04 63.75,71.75 72.77,71.75 73.53,70.99 73.53,70.1 73.91,69.72 73.91,69.09 73.95,69.05 IC9.6
DV_TX3
  Top 0.127: GPIO1.8 57.67,76.95 58.93,75.69 58.93,74.04 61.72,71.25 71.5,71.25 72.39,70.36 72.77,69.98 73.03,69.98 73.28,69.72 73.28,69.22 73.31,69.32 IC9.7
ETH_ACT
  Bottom 0.127: IC1.26 22.57,11.59 22.61,11.56 22.61,8.51 23.11,8 23.75,8 24.13,7.62 | R59.1 24.13,7.62 | 24.13,7.62 25.53,7.62 29.34,3.81 39.37,3.81 R52.1
ETH_CLK  (via drill 0.3)
  Top 0.127: v15.24,6.35 v15.24,9.14
  Bottom 0.127: GPIO0.4 2.8,6.47 2.92,6.35 3.81,6.35 5.08,7.62 6.35,7.62 7.62,6.35 11.43,6.35 | R32.2 11.43,5.08 11.43,6.35 | IC1.34 18.57,9.68 18.03,9.14 v15.24,9.14 | 11.43,6.35 v15.24,6.35
ETH_CLK_OUT
  Bottom 0.127: GPIO0.2 2.8,3.93 2.92,3.81 3.81,3.81 5.08,5.08 R32.1
ETH_COL
  Bottom 0.127: GPIO0.13 5.47,19.04 6.35,19.05 6.86,18.54 6.86,17.02 7.87,16 9.4,16 9.41,15.99 RN1.4
ETH_CRS
  Bottom 0.127: GPIO0.9 5.47,13.96 6.35,13.97 7.37,14.99 9.53,14.99 RN1.2
ETH_LNK
  Bottom 0.127: IC1.28 21.57,11.45 21.59,11.43 21.59,9.27 20.32,8 19.43,8 19.05,7.62 | R54.1 41.91,3.81 41.15,3.81 40.89,3.43 29.21,3.43 28.57,4.06 18.29,4.06 17.65,4.7 17.65,7.11 18.16,7.62 19.05,7.62 | 19.05,7.62 R57.1
ETH_MDC
  Bottom 0.127: GPIO0.6 2.8,8.88 3.81,8.89 5.08,10.16 11.56,10.16 13.21,8.51 17.91,8.51 18.92,9.53 20.07,9.53 20.45,9.91 20.45,10.79 20.07,11.18 20.07,11.43 IC1.31
ETH_MDIO
  Top 0.127: GPIO0.7 5.47,11.42 5.46,11.43 R31.1
ETH_RST_N
  Top 0.127: GPIO0.5 5.59,8.89 R21.2
  Bottom 0.127: GPIO0.5 5.34,9.01 5.46,8.89 11.05,8.89 11.94,8 19.05,8 19.3,8.26 20.19,8.26 21.21,9.27 21.21,11.3 21.08,11.43 21.08,11.68 21.07,11.7 IC1.29
ETH_RXCLK
  Top 0.127: GPIO0.1 5.34,3.93 5.46,3.81 R30.1
ETH_RXD0
  Bottom 0.127: GPIO0.14 2.93,19.04 3.81,19.05 5.08,20.32 6.35,20.32 7.37,21.34 7.37,22.99 7.75,23.37 9.53,23.37 RN2.1
ETH_RXD1
  Bottom 0.127: GPIO0.15 5.34,21.58 6.35,21.59 7.11,22.35 7.11,23.5 7.49,23.88 9.78,23.88 RN2.2
ETH_RXD2
  Bottom 0.127: GPIO0.16 2.93,21.58 3.81,21.59 5.08,22.86 6.35,22.86 6.86,23.37 6.86,24 7.24,24.38 RN2.3 9.53,24.38 RN2.3
ETH_RXD3
  Bottom 0.127: GPIO0.17 5.59,24.13 6.35,24.13 7.11,24.89 9.53,24.89 RN2.4
ETH_RXDV
  Bottom 0.127: GPIO0.8 2.93,11.42 3.81,11.43 5.08,12.7 6.35,12.7 8.13,14.48 9.54,14.49 RN1.1
ETH_RXER
  Bottom 0.127: GPIO0.10 2.93,13.96 3.81,13.97 5.08,15.24 6.35,15.24 6.6,15.49 9.4,15.49 9.39,15.49 RN1.3
ETH_SPD  (via drill 0.3)
  Top 0.127: v21.59,8.26 R53.1
  Bottom 0.127: IC1.27 22.07,11.59 22.1,11.56 22.1,8.76 v21.59,8.26 R58.1
ETH_TXCLK
  Top 0.127: GPIO0.3 5.46,6.35 R29.1
ETH_TXD0
  Bottom 0.127: GPIO0.19 5.34,26.79 5.46,26.67 6.35,26.67 6.86,26.16 11.56,26.16 15.24,22.48 17.91,22.48 18.54,21.84 18.54,21.59 18.57,21.56 IC1.3
ETH_TXD1
  Bottom 0.127: GPIO0.20 2.42,26.79 2.54,26.67 3.81,27.94 6.35,27.94 7.87,26.42 11.68,26.42 15.37,22.73 18.16,22.73 19.05,21.84 19.05,21.46 19.07,21.44 IC1.4
ETH_TXD2
  Bottom 0.127: GPIO0.21 5.47,29.2 6.35,29.21 8.89,26.67 11.81,26.67 15.49,22.99 18.41,22.99 19.56,21.84 19.56,21.59 19.57,21.58 IC1.5
ETH_TXD3
  Bottom 0.127: GPIO0.22 3.06,29.2 2.54,29.21 3.81,30.48 6.35,30.48 9.91,26.92 11.94,26.92 15.62,23.24 20.32,23.24 | IC1.6 20.07,21.46 20.07,22.23 20.32,22.48 20.32,23.24 | 20.32,23.24 R61.2
ETH_TXEN
  Bottom 0.127: GPIO0.18 2.93,24.12 3.81,24.13 5.08,25.4 6.35,25.4 6.86,25.91 11.43,25.91 15.11,22.23 17.65,22.23 18.03,21.84 18.03,21.72 18.07,21.63 IC1.2
FB  (via drill 0.3)
  Top 1.016: v16.51,12.06 16.51,12.7 | 16.51,12.7 19.05,12.7 | 23.11,15.24 v23.11,13.97 23.11,12.7 19.05,12.7 | 23.11,15.24 v23.11,16.76 | 16.51,12.7 C15.1 | 19.05,12.7 C20.1 | 23.11,15.24 C16.1
  Bottom 0.127: 23.33,14.26 IC1.23 | 23.11,14.22 23.37,14.22 23.33,14.26 | 23.11,14.22 23.33,14.26 | v23.11,13.97 23.11,14.22 | IC1.37 16.47,13.76 16.51,13.72 v16.51,12.06 | IC1.18 23.62,16.76 23.5,16.76 v23.11,16.76
GND  (via drill 0.3)
  Top 0.127: 10.16,55.88 2.54,55.88 | 2.54,55.88 1.27,55.88 1.27,39.37 2.54,39.37 2.66,39.49 GPIO0.30 2.92,39.37 | R19.1 10.16,54.61 10.16,55.88 | 11.43,55.88 12.06,55.25 UART1.M1 12.7,55.71 | 11.43,55.88 10.16,55.88 | UART1.M2 20.96,55.24 20.32,55.88 | 20.32,55.88 12.7,55.88 | 12.7,55.88 12.7,55.71 | 20.32,55.88 45.72,55.88 45.72,53.34 64.77,53.34 64.77,40.64 | 12.7,55.88 11.43,55.88 | v71.12,40.64 68.58,40.64 | 68.58,40.64 64.77,40.64 | 1.27,7.62 1.27,1.27 15.24,1.27 | 1.27,7.62 1.27,12.7 | 2.54,55.88 v2.54,54.61 | 71.12,1.27 v71.12,2.54 71.12,11.3 TX1.3 | 15.24,1.27 30.48,1.27 | 30.48,1.27 40.51,1.27 | 40.51,1.27 50.8,1.27 | 50.8,1.27 57.15,1.27 | 57.15,1.27 71.12,1.27 | 15.24,1.27 v15.24,2.54 16.51,2.54 16.51,10.16 15.24,10.16 15.24,16.51 16.51,16.51 | 71.12,1.27 74.93,1.27 | 74.93,16.51 74.93,19.05 77.47,19.05 77.47,22.86 C6.- 76.2,22.73 | 74.93,1.27 105.41,1.27 | 105.41,1.27 106.68,1.27 106.68,16.51 | 106.68,16.51 106.68,40.64 | 106.68,40.64 106.68,41.91 92.71,41.91 | 92.71,41.91 84.71,41.91 | 84.71,41.91 73.66,41.91 73.66,40.64 v74.93,40.64 | 106.68,40.64 v105.41,40.64 | 105.41,1.27 v105.41,2.54 | 74.93,1.27 v74.93,2.54 74.93,16.51 | UART1.M4 12.34,49.17 12.7,49.53 | 12.7,55.71 12.7,49.53 | 20.32,55.88 20.32,49.53 20.68,49.17 UART1.M3 21.23,49.17 21.59,49.53 24.13,49.53 25.18,48.48 HOST1.P$2 25.4,47.92 25.4,45.72 27.94,45.72 28.23,45.43 HOST1.4 | UART1.5 14.43,49.07 13.97,49.53 12.7,49.53 | 84.56,39.88 IC7.10 84.7,39.87 84.71,39.88 84.71,41.91 | 92.71,41.91 C25.1 | R35.2 93.98,27.94 93.98,30.48 | 93.98,30.48 93.98,30.73 94.23,30.48 C4.2 | 90.17,30.48 93.98,30.48 | 90.17,30.48 90.17,27.94 R14.1 | 90.17,30.48 v88.9,30.48 C26.1
  Top 0.127: C22.2 v86.36,30.48 85.09,30.48 | 85.09,30.48 85.09,27.94 R34.1 | 81.28,30.48 81.28,27.94 80.9,27.94 R36.1 | 85.09,30.48 81.28,30.48 | 81.28,30.48 C5.2 | IC7.19 89.91,34.66 89.92,34.67 89.92,36.45 v89.53,36.83 | 106.68,16.51 R6.2 | 74.93,16.51 R13.2 78.74,16.93 78.74,19.68 IC8.4 | v87.63,19.68 87.63,1.31 | 60.2,40.64 60.83,40.64 60.83,42.16 SD1.GND2 | SD1.CD1 60.06,40.52 60.07,40.51 60.2,40.64 | v60.2,39.37 60.2,40.64 | SD1.CD1 60.06,40.63 60.07,41.78 56.9,41.78 | SD1.6 56.91,41.01 56.9,41.02 56.9,41.78 | SD1.GND1 49.87,40.6 49.53,40.64 49.53,41.91 56.9,41.78 | v60.2,39.37 59.94,39.12 59.94,37.08 60.01,37.02 IC6.3 59.96,36.85 59.94,36.83 C3.1 | v60.2,39.37 60.2,40.46 SD1.CD1 | 64.77,40.64 64.77,36.83 | 64.77,36.83 C2.1 64.35,36.83 63.63,36.83 63.25,36.45 63.25,35.81 62.87,35.43 59.69,35.43 57.66,33.4 57.66,27.94 v55.12,27.94 53.98,27.94 54.02,27.77 IC5.7 | 57.15,1.27 RX1.2 | R21.1 10.29,8.89 10.29,7.62 1.27,7.62 | 40.51,1.27 40.64,1.4 | 21.59,17.78 v21.59,16.64 | C16.2 20.32,15.24 20.32,16.51 | 20.32,17.78 21.59,17.78 | 21.59,17.78 22.86,17.78 | v19.05,16.51 19.05,17.78 | IC3.1 36.24,37.17 36.32,37.08 36.32,36.96 36.2,36.83 38.1,36.83 | 38.1,36.83 C19.1 | v31.62,36.83 32.38,36.83 32.26,36.96 32.26,37.21 32.28,37.19 IC3.7 32.26,37.11 32.26,35.94 33.66,34.16 | v26.67,38.73 27.3,38.23 27.3,37.85 27.29,37.96 IC4.12 | IC3.4 34.29,37.59 34.42,37.72 v34.42,35.81 | 38.1,36.83 v39.37,36.83 40.64,36.83 C13.- | 19.05,38.1 21.59,38.1 v21.59,38.61 21.59,41.91 | 19.05,38.1 16.51,38.1 | 16.51,38.35 C17.1 16.51,38.1 | 19.05,38.1 R28.1 | R16.1 22.86,41.91 21.59,41.91 | 24.26,32.38 24.13,32.51 | 24.26,32.38 24.26,33.31 C18.1
  Top 0.127: IC3.13 35.59,32.35 35.31,32.51 35.31,34.16 33.66,34.16 | 33.66,34.16 33.66,32 33.53,31.88 33.53,31.5 IC3.10 33.66,31.38 33.66,30.23 30.73,30.23 | 46.35,19.05 50.8,19.05 50.8,1.27 | IC4.7 29.87,31.39 29.84,31.37 29.84,30.23 30.73,30.23 | IC4.2 26.64,31.27 26.67,31.24 v26.67,32.51 | 30.73,30.23 v30.73,31.88 | POW5V.1 4.32,20.32 4.32,16.51 | 4.32,12.7 4.32,16.51 | 4.32,16.51 3.81,16.51 2.93,16.5 GPIO0.12 2.53,16.63 2.54,16.51 1.27,16.51 1.27,12.7 | 12.19,12.7 v12.19,10.54 | 1.27,12.7 4.32,12.7 | 4.32,12.7 12.19,12.7 | 16.51,38.1 15.24,38.1 15.24,42.29 v13.46,42.29 | 21.59,41.91 C14.1 | 30.48,1.27 v30.48,5.08 | v24.13,32.38 24.26,32.38 | 64.77,36.83 67.31,36.83 67.31,25.4 48.26,25.4 C1.1 | R47.1 68.58,35.56 68.58,38.1 | 68.58,40.64 68.58,38.1 | 68.58,38.1 R48.1 | 30.48,15.62 38.61,15.62 38.61,8.89 40.77,8.89 46.35,14.48 46.35,19.05 | 30.48,15.62 30.48,8.89 v29.21,8.89 | 46.35,19.05 ETH1.8 | 16.51,16.51 C15.2 | 16.51,16.51 17.78,16.51 | 16.51,16.51 16.51,17.78 C27.2 | 17.78,16.51 C29.2 | 20.32,16.51 20.32,17.78 | v19.05,16.51 20.32,16.51 | v19.05,16.51 C20.2 | 17.78,16.51 v19.05,16.51 | 20.32,17.78 C12.2 | C28.2 22.95,18.2 22.99,18.16 22.99,17.91 22.86,17.78 | C30.- 15.24,29.21 | 12.19,12.7 12.7,12.7 12.7,19.18 v14.86,21.34 | 30.48,21.59 v25.4,21.59 | 30.48,15.62 30.48,21.59 | 30.48,21.59 v30.61,21.72 | 22.86,17.78 24.13,17.78 24.13,11.43 v23.88,11.43
  Bottom 0.127: 15.24,1.27 1.27,1.27 1.27,16.51 | GPIO0.12 2.66,16.63 2.54,16.51 1.27,16.51 | 50.8,1.27 71.12,1.27 | DEVICE1.M2 27.3,55.25 26.67,55.88 | v2.54,54.61 2.54,55.88 26.67,55.88 | 26.67,55.88 35.56,55.88 36.2,55.24 DEVICE1.M1 36.2,55.25 36.83,55.88 | 43.18,55.88 36.83,55.88 | 64.77,40.64 64.77,55.88 43.18,55.88 | 64.77,40.64 v71.12,40.64 v71.12,33.02 v71.12,2.54 71.12,1.27 | 106.68,19.68 106.68,2.54 v105.41,2.54 105.41,1.27 87.63,1.27 | 106.68,19.68 106.68,30.48 | 74.93,1.27 87.63,1.27 | 74.93,1.27 v74.93,2.54 74.93,7.62 | 71.12,1.27 74.93,1.27 | 74.93,7.62 74.93,19.05 | 89.66,36.83 v74.93,36.83 v74.93,40.64 73.66,40.64 73.66,41.91 88.9,41.91 | 88.9,41.91 105.41,41.91 v105.41,40.64 | 74.93,7.62 SP1.3 | LINE1.1 87.71,2.62 87.63,2.54 87.63,1.27 | C7.1 69.85,15.24 TX1.3 | C8.1 57.15,15.11 RX1.2 | 26.67,55.88 26.67,50.8 27.3,50.17 DEVICE1.M3 27.3,48.89 26.67,48.26 25.3,48.26 HOST1.P$2 25.4,47.92 25.4,41.27 | DEVICE1.5 33.83,49.07 34.29,49.53 35.84,49.53 DEVICE1.M4 | DEVICE1.M4 36.2,50.17 36.83,50.8 36.83,55.88 | 38.1,48.26 38.22,48.14 HOST1.P$1 38.2,48.26 36.83,48.26 36.2,48.89 DEVICE1.M4 | v86.36,30.48 v88.9,30.48 106.68,30.48 | 88.9,41.91 88.9,36.7 89.03,36.83 v89.53,36.83 | v105.41,40.64 105.41,40.26 | v105.41,40.64 106.68,40.64 106.68,30.48 | 106.68,19.68 v87.63,19.68 v82.55,19.68 | 64.77,40.64 64.77,38.1 | 64.77,38.1 60.2,38.1 v60.2,39.37 | C10.2 43.18,8.51 50.8,8.51 50.8,1.27 | 25.4,8.89 v29.21,8.89 33.02,8.89 33.02,8.51 38.1,8.51 C11.2 | 25.4,8.89 R51.2 | IC1.19 23.63,16.26 23.5,16.26 23.37,16.13 21.59,16.13 v21.59,16.64 21.59,18.16 | IC1.47 17.05,18.76 17.14,18.67 18.8,18.67 19.05,18.41 v19.05,16.51 19.05,15.24 18.03,15.24 18.03,13.46
  Bottom 0.127: 17.57,11.47 IC1.36 17.53,12.95 17.53,13.46 18.03,13.46 | 17.57,11.47 18.03,11.43 18.07,11.47 IC1.35 18.03,13.21 18.03,13.46 | v31.62,36.83 29.21,36.83 29.21,37.85 26.67,37.85 v26.67,38.73 | IC2.13 21.4,41.59 21.46,41.53 21.72,41.53 21.97,41.27 22.86,41.27 | v26.67,38.73 26.67,41.27 25.4,41.27 | v26.67,38.73 26.67,38.61 | 25.4,41.27 22.86,41.27 | 22.86,41.27 22.86,38.61 v21.59,38.61 | 26.67,33.15 30.73,33.15 v30.73,31.88 | 26.67,33.15 v26.67,32.51 | v34.42,35.81 34.42,36.83 v39.37,36.83 43.18,36.83 43.18,55.88 | R61.1 20.32,25.4 14.73,25.4 9.65,30.48 9.65,33.02 1.27,33.02 1.27,16.51 | R60.1 13.97,12.7 13.97,10.16 | 13.97,10.16 15.24,10.16 16,10.92 17.27,10.92 17.53,11.18 17.53,11.43 17.57,11.47 | 13.97,10.16 12.19,10.16 v12.19,10.54 | IC1.15 23.52,18.26 23.5,18.29 23.5,18.16 21.59,18.16 | IC2.5 15.18,42.23 15.24,42.29 v13.46,42.29 | 15.24,1.27 50.8,1.27 | v15.24,2.54 15.24,1.27 | 26.67,33.15 24.13,33.15 v24.13,32.38 | GPIO0.30 2.93,39.36 3.81,39.37 3.81,40.64 POW3V3.1 13.97,35.56 C30.- 15.24,29.21 | 16.55,18.76 15.11,18.8 14.99,18.8 14.86,18.92 v14.86,21.34 | 21.59,18.16 21.59,19.05 22.86,19.05 v25.4,21.59 | 25.4,8.89 23.88,8.89 v23.88,11.43 | 64.77,38.1 67.31,38.1 67.31,33.02 62.23,27.94 v55.12,27.94
  pour Top (isolate 0.254): 1.27,57.15 64.77,57.15 66.04,55.88 66.04,41.91 72.39,41.91 72.39,2.54 73.66,2.54 73.66,41.91 106.68,41.91 106.68,1.27 1.27,1.27
  pour Bottom (isolate 0.254): 1.27,1.27 1.27,57.15 64.77,57.15 66.04,55.88 66.04,41.91 72.39,41.91 72.39,2.54 73.66,2.54 73.66,41.91 106.68,41.91 106.68,1.27
LED_ACT
  Bottom 0.127: R52.2 39.37,6.35 37.97,6.35 36.83,7.49 | ETH1.10 36.85,7.59 36.83,7.49 | 36.83,7.49 36.96,7.49
LED_LNK
  Bottom 0.127: 44.42,6.33 ETH1.11 | 44.42,6.33 44.45,6.22 44.45,6.35 41.91,6.35 R54.2 | 44.42,6.33 44.45,6.1
LED_SPD
  Top 0.127: R53.2 21.59,3.81 25.4,3.81 SPD.K
N$1  (via drill 0.3)
  Top 0.127: IC9.16 77.2,62.85 77.22,62.61 77.22,55.5 v74.93,53.21
  Bottom 0.127: v74.93,53.21 73.79,52.07 72.9,52.07 71.63,53.34 71.63,53.38 C48.1
N$2
  Bottom 0.127: IC10.38 80.3,53.63 80.26,53.59 80.01,53.59 79.76,53.34 C47.2
N$3
  Bottom 0.127: IC10.39 80.17,54.13 80.14,54.1 80.01,54.1 79.76,53.85 79.5,53.85 78.61,54.74 74.68,54.74 73.28,53.34 C48.2
N$4
  Bottom 0.127: IC10.41 80.4,55.13 80.39,55.12 80.14,55.12 80.01,55.24 79.76,55.24 79.12,55.88 C49.2
N$5
  Bottom 0.406: SP1.2 79.25,10.16 82.3,13.21 91.95,13.21 92,13.26 LINE1.4
N$6
  Top 0.127: UART1.3 16.51,47.24 16,46.74 14.48,46.74 13.97,46.23 R12.2
N$7  (via drill 0.3)
  Top 0.127: R12.1 13.97,43.18 v12.7,43.18
  Bottom 0.127: IC2.8 14.73,44.2 13.72,44.2 v12.7,43.18
N$8  (via drill 0.3)
  Top 0.127: v26.29,43.56 25.4,42.67 R33.2
  Bottom 0.127: DEVICE1.1 30.15,47.93 30.1,47.88 30.1,47.12 29.59,46.61 29.59,44.7 29.08,44.2 26.92,44.2 v26.29,43.56
N$9
  Bottom 0.406: LINE1.3 85.24,9.04 81.28,5.08 SP1.4
N$10  (via drill 0.3)
  Top 0.127: v18.41,36.83 R10.2
  Bottom 0.127: v18.41,36.83 15.62,39.62 14.73,39.62 IC2.1
N$11
  Top 0.406: 78.74,28.07 78.74,25.4 C24.1 | R2.2 78.74,33.02 78.74,30.48 | 78.74,28.07 R36.2 | 78.74,30.48 C5.1 | 78.74,28.07 78.74,30.48
N$12
  Top 0.406: C23.1 96.52,25.4 96.52,27.81 96.39,27.94 R35.1 96.52,27.94 96.52,30.48 | 96.52,33.02 R1.2 96.52,32.98 96.52,30.48 | 96.52,30.48 C4.1
N$13
  Top 0.406: 89.25,33.02 89.25,32.92 89.41,32.77 91.06,32.77 91.31,33.02 R1.1 | 89.25,33.02 IC7.18 | 88.61,33.06 IC7.17 | 88.61,33.06 88.65,33.02 89.25,33.02 | IC7.16 87.95,33.09 87.88,33.02 | 87.88,33.02 88.56,33.02 88.61,33.06 | IC7.15 87.31,33.09 87.38,33.02 87.88,33.02
N$14
  Top 0.406: IC7.11 84.7,33.02 84.71,33.02 | R2.1 84.71,33.02 | IC7.12 85.36,33.03 85.34,33.02 | 84.71,33.02 85.34,33.02 | 86,33.05 IC7.13 | 86,33.05 85.98,33.02 85.34,33.02 | IC7.14 86.66,33.06 86.61,33.02 86.03,33.02 86,33.05
N$15
  Top 0.406: 92.71,25.4 92.71,20.95 91.44,19.68 IC8.5 | R14.2 92.71,28.07 92.71,25.4 | 92.71,25.4 R3.1 | 92.71,25.4 C23.2
N$16
  Top 0.406: R34.2 82.55,27.94 82.55,25.4 | 82.55,25.4 R4.1 | 82.55,25.4 C24.2 | 82.55,25.4 82.55,22.23 83.82,20.95 IC8.3
N$17
  Top 0.127: IC6.4 59.72,34.26 59.69,34.29 R5.1
N$18
  Bottom 0.127: RX1.3 R9.2
N$19  (via drill 0.3)
  Top 0.127: v10.92,52.07 R49.2
  Bottom 0.127: v10.92,52.07 11.18,52.07 11.43,51.82 11.43,50.55 16.89,45.09 16.89,42.67 15.88,41.66 14.85,41.66 IC2.4
N$20  (via drill 0.3)
  Top 0.127: R16.2 22.86,39.37 25.4,39.37 v25.4,38.73 R33.1 | IC3.8 32.34,31.7 32.38,31.62 32.26,31.62 v32.26,34.92
  Bottom 0.127: v32.26,34.92 31.88,34.54 28.32,34.54 25.4,37.47 v25.4,38.73
N$21
  Top 0.406: IC8.7 88.65,22.23 88.65,20.95 | 88.65,20.95 IC8.6 | 88.65,20.95 88.65,16.76 88.9,16.51 C9.1
N$22
  Top 0.127: UART1.1 18.11,47.17 19.05,46.23 R26.2
N$23
  Top 0.406: IC8.1 86.61,23.5 86.61,22.23 | 86.61,22.23 IC8.2 | 86.61,22.23 86.61,16.76 86.36,16.51 C21.1
N$24
  Top 0.127: UART1.2 17.31,47.16 16.51,46.35 R11.2
N$25  (via drill 0.3)
  Top 0.127: IC9.13 75.25,62.54 75.31,62.48 75.31,62.36 76.33,61.34 76.33,57.78 v74.93,56.39
  Bottom 0.127: v74.93,56.39 74.17,55.63 74.17,55.12 73.66,54.61 72.9,54.61 71.88,55.63 72.01,55.84 71.75,55.88 C50.1
N$26  (via drill 0.3)
  Top 0.127: IC9.11 73.95,62.52 73.91,62.48 75.06,61.34 75.31,61.34 75.69,60.96 75.69,59.31 v74.93,58.55
  Bottom 0.127: v74.93,58.55 75.06,58.42 C51.1
N$27  (via drill 0.3)
  Top 0.127: IC9.12 74.61,62.67 74.55,62.48 75.44,61.59 75.56,61.59 75.95,61.21 75.95,58.67 v74.93,57.66
  Bottom 0.127: v74.93,57.66 74.3,57.66 73.79,57.15 72.9,57.15 71.63,58.42 C52.1
N$28  (via drill 0.3)
  Top 0.127: IC9.10 73.31,62.64 73.28,62.61 73.28,62.48 74.93,60.83 v74.93,60.71
  Bottom 0.127: 75.06,60.96 v74.93,60.71 74.93,60.96 C53.1
N$29  (via drill 0.3)
  Top 0.127: IC4.6 29.11,31.47 29.21,31.5 29.21,34.42 30.73,35.94 v30.73,37.85 | v38.1,42.55 R15.2
  Bottom 0.127: v30.73,37.85 35.43,42.55 v38.1,42.55
N$30  (via drill 0.3)
  Top 0.127: IC4.8 29.89,37.42 29.84,37.21 29.84,38.1 v30.48,38.73 | v30.48,42.55 R20.2
  Bottom 0.127: v30.48,38.73 v30.48,42.55
N$31  (via drill 0.3)
  Top 0.127: R28.2 v19.05,42.55 | v19.05,42.55 19.05,43.18 | v19.05,42.55 R26.1
  Bottom 0.127: IC2.11 20.26,42.86 20.07,42.8 19.81,42.8 19.56,42.55 v19.05,42.55
N$32  (via drill 0.3)
  Top 0.127: v17.78,43.81 17.78,43.18 16.51,43.18 R11.1
  Bottom 0.127: IC2.9 20.26,44.13 20.19,44.2 18.16,44.2 v17.78,43.81
N$33  (via drill 0.3)
  Top 0.127: IC3.11 v34.29,32.64 34.29,32.77 | v20.7,35.18 20.7,36.83 R10.1 21.21,36.83 21.46,36.83 21.59,36.83
  Bottom 0.127: v34.29,32.64 32.89,34.04 28.07,34.04 26.92,35.18 26.42,35.18 25.91,34.67 21.21,34.67 v20.7,35.18
N$34  (via drill 0.3)
  Top 0.127: RN3.1 52.59,36.46 52.58,36.2 52.58,35.69 v52.07,35.18 | 51.44,27.59 51.44,27.56 | 51.44,27.59 51.44,30.1 v52.07,30.73 | IC5.3 51.44,27.59
  Bottom 0.127: v52.07,30.73 v52.07,35.18
N$35  (via drill 0.3)
  Top 0.127: v14.61,11.05 13.46,9.91 13.46,6.73 10.54,3.81 R30.2
  Bottom 0.127: IC1.38 15.33,14.26 15.24,14.22 14.86,14.22 14.61,13.97 v14.61,11.05
N$36  (via drill 0.3)
  Top 0.406: v16.76,41.53 16.51,41.27 16.51,41.02 16.47,40.47 C17.2
  Bottom 0.406: IC2.10 19.62,43.5 19.56,43.43 18.67,43.43 v16.76,41.53 16.26,41.02 15.88,41.02 15.81,40.96 IC2.3
N$37  (via drill 0.3)
  Top 0.127: 53.34,27.3 53.37,27.34 IC5.6 53.37,27.21 53.34,27.56 | 53.34,27.3 53.34,26.8 53.47,26.67 58.42,26.67 59.69,27.94 R5.2 | 53.34,27.56 53.34,27.3 | R39.2 11.81,35.56 16.64,30.73 v17.53,30.73 | v52.96,29.59 53.34,29.21 53.34,27.56
  Bottom 0.127: v17.53,30.73 18.41,30.73 19.18,29.97 50.42,29.97 50.67,29.72 52.7,29.72 v52.96,29.59
N$38
  Top 0.127: RN3.4 54.09,36.08 54.1,36.32 54.1,34.67 54.74,34.04 54.74,32.64 53.98,31.88 53.98,31.5 52.07,29.59 52.07,29.08 52.7,28.45 52.7,27.59 IC5.5
N$39  (via drill 0.3)
  Top 0.127: IC4.3 27.29,32.24 27.3,32.38 27.3,34.04 v28.57,35.31 | v40.64,42.55 R17.1
  Bottom 0.127: v28.57,35.31 31.62,35.31 36.58,40.26 38.35,40.26 v40.64,42.55
N$40
  Top 0.127: IC3.3 34.94,37.7 34.92,37.72 34.92,38.73 35.56,39.37 | 35.56,39.37 R7.1 | 35.56,39.37 38.1,39.37 | 38.1,39.37 40.22,39.37 | 40.22,39.37 R17.2 | 40.22,39.37 40.64,39.37 | 38.1,39.5 R15.1 | 38.1,39.5 38.23,39.37 | 38.1,39.37 38.1,39.5
N$41
  Top 0.127: RN3.2 53.09,36.32 53.09,36.2 53.09,35.18 52.07,34.16 IC5.11
N$42
  Top 0.127: RN3.3 53.59,36.07 RN3.3 53.59,34.54 53.98,34.16 53.98,33.42 IC5.8
N$43
  Bottom 0.127: RN1.8 10.67,14.48 11.43,14.48 | 11.43,14.48 11.68,14.73 15.24,14.73 15.27,14.76 IC1.39 | R60.2 11.56,12.7 11.43,12.57 11.43,14.48
N$45  (via drill 0.3)
  Top 0.127: IC4.11 v27.94,38.73 | v27.94,42.55 R18.1
  Bottom 0.127: v27.94,38.73 v27.94,42.55
N$46  (via drill 0.3)
  Top 0.127: SD1.1 51.41,40.28 51.44,40.28 | v51.44,39.37 51.44,40.28 | 51.44,40.28 51.44,40.64
  Bottom 0.127: v51.44,39.37 50.16,40.64 49.02,40.64 48.26,41.4 R41.1
N$47  (via drill 0.3)
  Top 0.127: SD1.8 59.11,40.71 59.18,40.64 v59.18,39.37
  Bottom 0.127: v59.18,39.37 60.96,41.15 R23.1
N$48
  Bottom 0.127: IC1.40 15.13,15.26 15.11,15.24 11.68,15.24 11.43,14.99 10.79,14.99 RN1.7
N$51  (via drill 0.3)
  Top 0.127: IC9.9 72.66,63 72.64,62.99 72.64,62.36 74.3,60.71 74.3,60.45 v74.93,59.82
  Bottom 0.127: v74.93,59.82 74.93,59.69 72.77,59.69 71.63,60.83 71.5,60.67 71.88,60.71 71.63,60.96 C54.1
N$52
  Bottom 0.127: IC10.23 87.47,53.63 87.5,53.59 89.03,53.59 89.1,53.67 DIGITAL1.1
N$53
  Bottom 0.127: IC1.41 16.01,15.76 16,15.75 11.68,15.75 11.43,15.49 RN1.6 10.92,15.49 RN1.6
N$54  (via drill 3.2)
  other vias: 103.5,65.02
  pour Bottom (isolate 0.254): 102.87,67.31 106.68,67.31 106.68,43.18 101.6,43.18 101.6,66.04
  pour Top (isolate 0.254): 102.87,67.31 106.68,67.31 106.68,43.18 101.6,43.18 101.6,66.04
N$55
  Bottom 0.127: RN1.5 10.78,15.99 10.92,16 11.43,16 11.68,16.26 15.49,16.26 15.62,16.26 IC1.42
N$56